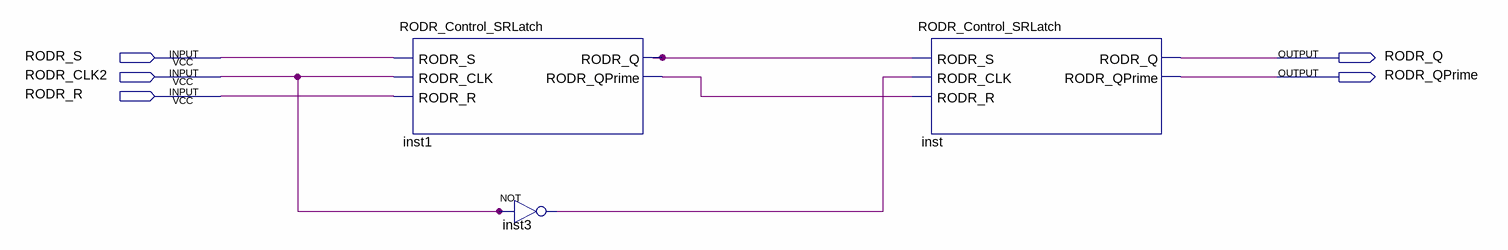
[diagram p0: schematic sheet]
// Quartus schematic RODR_MasSlave_SR_FlipFlop.bdf as structural Verilog: 3 symbols, 5 pins
module RODR_MasSlave_SR_FlipFlop (
  input  RODR_S,
  input  RODR_CLK2,
  input  RODR_R,
  output RODR_Q,
  output RODR_QPrime
);

  wire inst1_rodr_q, inst1_rodr_qprime, inst3_out;

  RODR_Control_SRLatch inst1 (
    .RODR_S(RODR_S), .RODR_CLK(RODR_CLK2), .RODR_R(RODR_R), .RODR_Q(inst1_rodr_q),
    .RODR_QPrime(inst1_rodr_qprime));
  not inst3 (inst3_out, RODR_CLK2);
  RODR_Control_SRLatch inst (
    .RODR_S(inst1_rodr_q), .RODR_CLK(inst3_out), .RODR_R(inst1_rodr_qprime), .RODR_Q(RODR_Q),
    .RODR_QPrime(RODR_QPrime));
endmodule
